# EasyEDA Pro project CH32V203_Wireless_Charge_V1.1.eprj, schematic CH32V203_Wireless_Charge
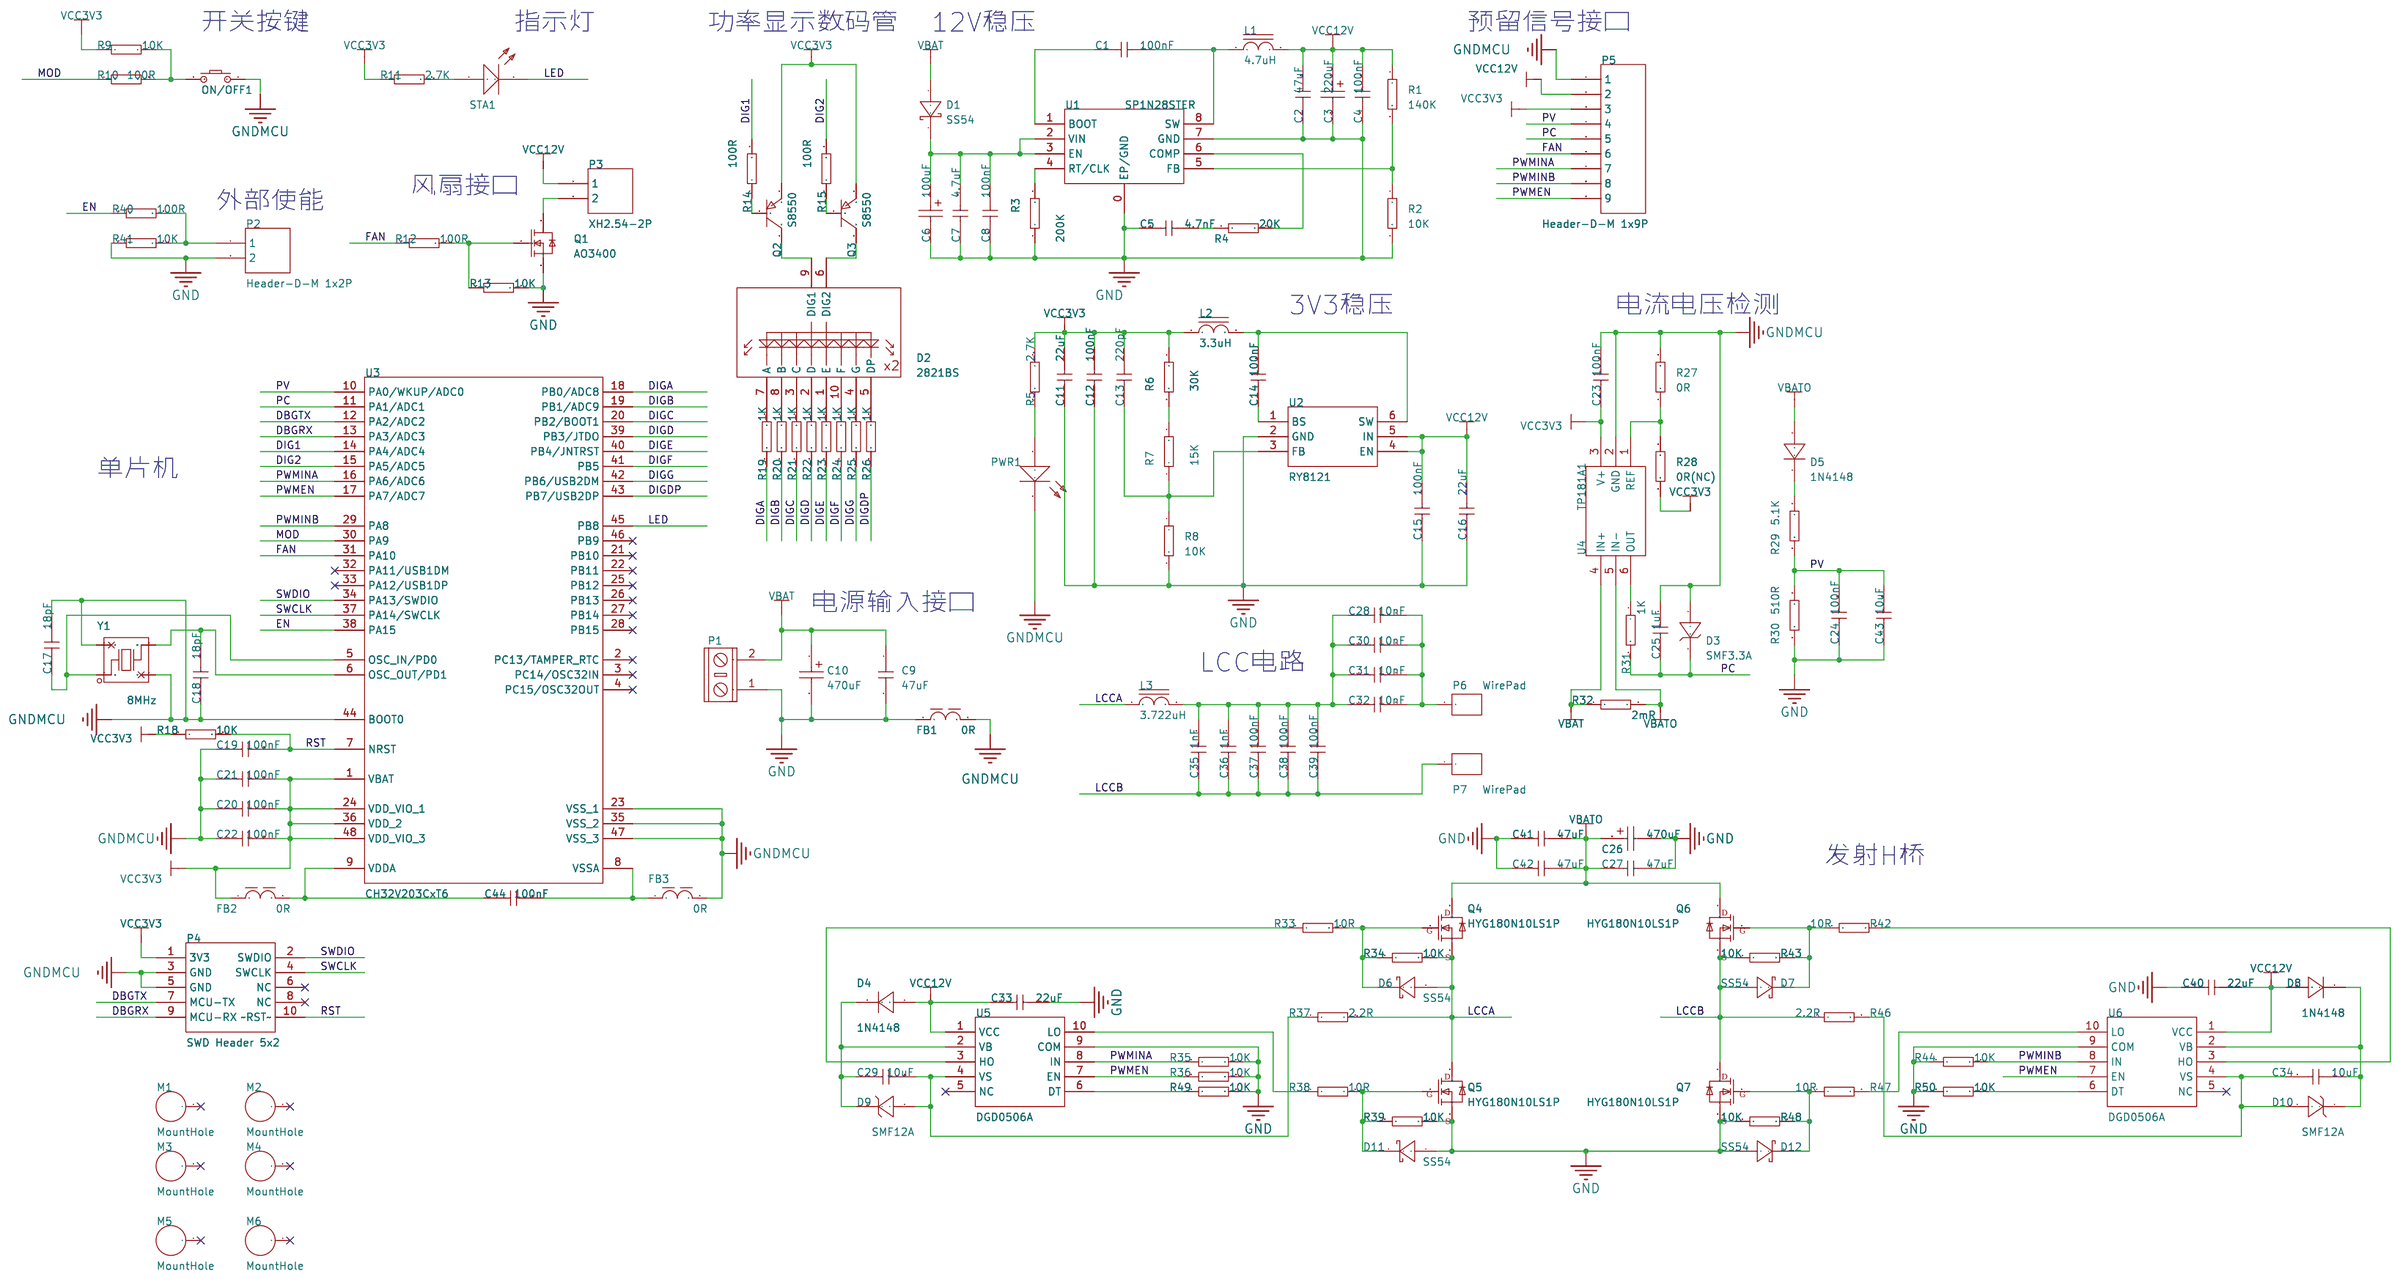
[diagram p0: schematic sheet]

## Parts
C1  100nF  [CAPC1608[0603]S-N]
C2  47uF  [CAPC3216[1206]S]
C3  220uF  [Cap-S-D 2.5-6.3X8]
C4  100nF  [CAPC1608[0603]S-N]
C5  4.7nF  [CAPC1608[0603]S-N]
C6  100uF  [Cap-S-D 2.5-6.3X8]
C7  4.7uF  [CAPC3216[1206]S]
C8  100nF  [CAPC1608[0603]S-N]
C9  47uF  [CAPC4532[1812]S]
C10  470uF  [Cap-S-D 3.5-8x14]
C11  22uF  [CAPC2012[0805]S-N]
C12  100nF  [CAPC1608[0603]S-N]
C13  220pF  [CAPC1608[0603]S-N]
C14  100nF  [CAPC1608[0603]S-N]
C15  100nF  [CAPC1608[0603]S-N]
C16  22uF  [CAPC2012[0805]S-N]
C17  18pF  [CAPC1608[0603]S-N]
C18  18pF  [CAPC1608[0603]S-N]
C19  100nF  [CAPC1608[0603]S-N]
C20  100nF  [CAPC1608[0603]S-N]
C21  100nF  [CAPC1608[0603]S-N]
C22  100nF  [CAPC1608[0603]S-N]
C23  100nF  [CAPC1608[0603]S-N]
C24  100nF  [CAPC1608[0603]S-N]
C25  1uF  [CAPC1608[0603]S-N]
C26  470uF  [Cap-S-D 3.5-8x14]
C27  47uF  [CAPC4532[1812]S]
C28  10nF  [CAPC3216[1206]S]
C29  10uF  [CAPC2012[0805]S-N]
C30  10nF  [CAPC3216[1206]S]
C31  10nF  [CAPC3216[1206]S]
C32  10nF  [CAPC3216[1206]S]
C33  22uF  [CAPC2012[0805]S-N]
C34  10uF  [CAPC2012[0805]S-N]
C35  1nF  [CAPC3216[1206]S]
C36  1nF  [CAPC3216[1206]S]
C37  100nF  [CAPC3216[1206]S]
C38  100nF  [CAPC3216[1206]S]
C39  100nF  [CAPC3216[1206]S]
C40  22uF  [CAPC2012[0805]S-N]
C41  47uF  [CAPC4532[1812]S]
C42  47uF  [CAPC4532[1812]S]
C43  10uF  [CAPC2012[0805]S-N]
C44  100nF  [CAPC1608[0603]S-N]
D1  SS54  [SMA-L[DO-214AC]]
D2  2821BS  [2821AS/BS]
D3  SMF3.3A  [SOD-123-L]
D4  1N4148  [SOD-123-L]
D5  1N4148  [SOD-123-L]
D6  SS54  [SMA-L[DO-214AC]]
D7  SS54  [SMA-L[DO-214AC]]
D8  1N4148  [SOD-123-L]
D9  SMF12A  [SOD-123-L]
D10  SMF12A  [SOD-123-L]
D11  SS54  [SMA-L[DO-214AC]]
D12  SS54  [SMA-L[DO-214AC]]
FB1  0R  [INDC1608[0603]S]
FB2  0R  [INDC1608[0603]S]
FB3  0R  [INDC1608[0603]S]
L1  4.7uH  [0630 TPC 7*7*3]
L2  3.3uH  [0402 TPC 4*4*2]
L3  3.722uH  [T94/106-LAY]
M1  MountHole  [M3-MountHole-Plated]
M2  MountHole  [M3-MountHole-Plated]
M3  MountHole  [M3-MountHole-Plated]
M4  MountHole  [M3-MountHole-Plated]
M5  MountHole  [M3-MountHole-Plated]
M6  MountHole  [M3-MountHole-Plated]
ON/OFF1  Button  [KEY-2-DIP-6*6-S]
P1  KF/WJ/DG 30x connecter  [KF/WJ/DG 301-2p-5.0mm]
P2  Header-D-M 1x2P  [HDR1X2-M]
P3  XH2.54-2P  [XH2.54-2P-DV]
P4  SWD  [HDR2X5-M]
P5  Header-D-M 1x9P  [HDR1X9-M]
P6  WirePad  [WirePad-4x6]
P7  WirePad  [WirePad-4x6]
PWR1  LED 3R  [LED-R3-H5-SINGLE-R]
Q1  AO3400  [SOT-23]
Q2  S8550  [SOT-23]
Q3  S8550  [SOT-23]
Q4  HYG180N10LS1P  [TO-220-LAY]
Q5  HYG180N10LS1P  [TO-220-LAY]
Q6  HYG180N10LS1P  [TO-220-LAY]
Q7  HYG180N10LS1P  [TO-220-LAY]
R1  140K  [RESC1608[0603]S-N]
R2  10K  [RESC1608[0603]S-N]
R3  200K  [RESC1608[0603]S-N]
R4  20K  [RESC1608[0603]S-N]
R5  2.7K  [RESC1608[0603]S-N]
R6  30K  [RESC1608[0603]S-N]
R7  15K  [RESC1608[0603]S-N]
R8  10K  [RESC1608[0603]S-N]
R9  10K  [RESC1608[0603]S-N]
R10  100R  [RESC1608[0603]S-N]
R11  2.7K  [RESC1608[0603]S-N]
R12  100R  [RESC1608[0603]S-N]
R13  10K  [RESC1608[0603]S-N]
R14  100R  [RESC1608[0603]S-N]
R15  100R  [RESC1608[0603]S-N]
R18  10K  [RESC1608[0603]S-N]
R19  1K  [RESC1608[0603]S-N]
R20  1K  [RESC1608[0603]S-N]
R21  1K  [RESC1608[0603]S-N]
R22  1K  [RESC1608[0603]S-N]
R23  1K  [RESC1608[0603]S-N]
R24  1K  [RESC1608[0603]S-N]
R25  1K  [RESC1608[0603]S-N]
R26  1K  [RESC1608[0603]S-N]
R27  0R  [RESC1608[0603]S-N]
R28  0R(NC)  [RESC1608[0603]S-N]
R29  5.1K  [RESC1608[0603]S-N]
R30  510R  [RESC1608[0603]S-N]
R31  1K  [RESC1608[0603]S-N]
R32  2mR  [RESC6332[2512]S]
R33  10R  [RESC2012[0805]S-N]
R34  10K  [RESC1608[0603]S-N]
R35  10K  [RESC1608[0603]S-N]
R36  10K  [RESC1608[0603]S-N]
R37  2.2R  [RESC2012[0805]S-N]
R38  10R  [RESC2012[0805]S-N]
R39  10K  [RESC1608[0603]S-N]
R40  100R  [RESC1608[0603]S-N]
R41  10K  [RESC1608[0603]S-N]
R42  10R  [RESC2012[0805]S-N]
R43  10K  [RESC1608[0603]S-N]
R44  10K  [RESC1608[0603]S-N]
R46  2.2R  [RESC2012[0805]S-N]
R47  10R  [RESC2012[0805]S-N]
R48  10K  [RESC1608[0603]S-N]
R49  10K  [RESC1608[0603]S-N]
R50  10K  [RESC1608[0603]S-N]
STA1  LED  [LED-R3-H5-SINGLE-B]
U1  SP1N28STER  [SOP-8E]
U2  RY8121  [SOT-23-6]
U3  CH32V203CxT6  [LQFP48_L]
U4  TP181A1  [SOT-363]
U5  DGD0506A  [MSOP-10]
U6  DGD0506A  [MSOP-10]
Y1  8MHz  [X3225-4]

## Library data of the parts
C1 C4 C8 C12 C14 C15 C19-C24 C44 = 100nF 0603 50V X7R: Revision: V1.0; Voltage: 50V; Type: X7R; Origin Footprint 2: CAPC1608[0603]-L; Origin Footprint 3: CAPC1608[0603]-M; Origin Footprint 4: CAPC1608[0603]-N; Origin Footprint 5: CAPC1608[0603]S-L; Origin Footprint 6: CAPC1608[0603]S-M
C2 = 47uF 1206 25V X5R: Revision: V1.0; Voltage: 25V; Type: X5R; Origin Footprint 2: CAPC3216[1206]
C3 = S-D 220uF 25V 6.3x8: Revision: V1.0; Type: 聚合物固态; Voltage: 25V
C5 = 4.7nF 0603 50V X7R: Revision: V1.0; Voltage: 50V; Type: X7R; Origin Footprint 2: CAPC1608[0603]-L; Origin Footprint 3: CAPC1608[0603]-M; Origin Footprint 4: CAPC1608[0603]-N; Origin Footprint 5: CAPC1608[0603]S-L; Origin Footprint 6: CAPC1608[0603]S-M
C6 = S-D 100uF 35V 6.3x8: Revision: V1.0; Type: 聚合物固态; Voltage: 35V
C7 = 4.7uF 1206 35V X5R: Revision: V1.0; Voltage: 35V; Type: X5R; Origin Footprint 2: CAPC3216[1206]
C9 C27 C41 C42 = 47uF 1812 50V X5R: Revision: V1.0; Voltage: 50V; Type: X5R; Origin Footprint 2: CAPC4532[1812]
C10 C26 = S-D 470uF 35V 8x14: Revision: V1.0; Type: 聚合物固态; Voltage: 35V
C11 C16 C33 C40 = 22uF 0805 25V X5R: Revision: V1.0; Voltage: 25V; Type: X5R; Origin Footprint 2: CAPC2012[0805]; Origin Footprint 3: CAPC2012[0805]S-L; Origin Footprint 4: CAPC2012[0805]S-M
C13 = 220pF 0603 50V X7R: Revision: V1.0; Voltage: 50V; Type: X7R; Origin Footprint 2: CAPC1608[0603]-L; Origin Footprint 3: CAPC1608[0603]-M; Origin Footprint 4: CAPC1608[0603]-N; Origin Footprint 5: CAPC1608[0603]S-L; Origin Footprint 6: CAPC1608[0603]S-M
C17 C18 = 18pF 0603 50V COG: Revision: V1.0; Voltage: 50V; Type: COG; Origin Footprint 2: CAPC1608[0603]-L; Origin Footprint 3: CAPC1608[0603]-M; Origin Footprint 4: CAPC1608[0603]-N; Origin Footprint 5: CAPC1608[0603]S-L; Origin Footprint 6: CAPC1608[0603]S-M
C25 = 1uF 0603 16V X7R: Revision: V1.0; Voltage: 16V; Type: X7R; Origin Footprint 2: CAPC1608[0603]-L; Origin Footprint 3: CAPC1608[0603]-M; Origin Footprint 4: CAPC1608[0603]-N; Origin Footprint 5: CAPC1608[0603]S-L; Origin Footprint 6: CAPC1608[0603]S-M
C28 C30-C32 = 10nF 1206 100V C0G: Revision: V1.0; Voltage: 100V; Type: C0G; Origin Footprint 2: CAPC3216[1206]
C29 C34 C43 = 10uF 0805 25V X5R: Revision: V1.0; Voltage: 25V; Type: X5R; Origin Footprint 2: CAPC2012[0805]; Origin Footprint 3: CAPC2012[0805]S-L; Origin Footprint 4: CAPC2012[0805]S-M
C35 C36 = 1nF 1206 100V C0G: Revision: V1.0; Voltage: 100V; Type: C0G; Origin Footprint 2: CAPC3216[1206]
C37-C39 = 100nF 1206 100V C0G: Revision: V1.0; Voltage: 100V; Type: C0G; Origin Footprint 2: CAPC3216[1206]
D1 D6 D7 D11 D12 = SS54: Revision: V1.0
D2 = 2821BS
D3 = Diode TVS Uni-Dir_1: Published: 8-Jun-2000; Publisher: Altium Limited; Price(RMB): 0.000; Imax: 500mA; Origin Footprint 2: DO-41; Origin Footprint 3: SMA[DO-214AC]; Origin Footprint 4: SMB[DO-214AA]; Origin Footprint 5: SMC[DO-214AB]; Origin Footprint 6: SOD-123-FL; Origin Footprint 7: SOD-323; Origin Footprint 8: SOD-523-L; Origin Footprint 9: SOD-123-M; Origin Footprint 10: SOD-523-M
D4 D5 D8 = Diode: Published: 8-Jun-2000; Revision: July-2002: Re-released for DXP Platform.; Publisher: Altium Limited; Price(RMB): 0.000; Imax: 500mA; Origin Footprint 2: SMB[DO-214AA]; Origin Footprint 3: SMC[DO-214AB]; Origin Footprint 4: SMA[DO-214AC]; Origin Footprint 5: SOD-123-FL; Origin Footprint 6: SOD-123-M; Origin Footprint 7: SOD-323; Origin Footprint 8: SOD-523-L; Origin Footprint 9: SOD-523-M
D9 D10 = Diode TVS Uni-Dir: Published: 8-Jun-2000; Publisher: Altium Limited; Price(RMB): 0.000; Imax: 500mA; Origin Footprint 2: DO-41; Origin Footprint 3: SMA[DO-214AC]; Origin Footprint 4: SMB[DO-214AA]; Origin Footprint 5: SMC[DO-214AB]; Origin Footprint 6: SOD-123-FL; Origin Footprint 7: SOD-323; Origin Footprint 8: SOD-523-L; Origin Footprint 9: SOD-123-M; Origin Footprint 10: SOD-523-M
FB1-FB3 = FB-Chip: Published: 2020-12-18; Revision: V1.0; DCR: .1m; Frequency: @100MHz; Imax: 500mA; Origin Footprint 2: INDC2012[0805]S; Origin Footprint 3: INDC3216[1206]S; Origin Footprint 4: INDC4509[1806]S; Origin Footprint 5: INDC1005[0402]; Origin Footprint 6: INDC1608[0603]; Origin Footprint 7: INDC2012[0805]; Origin Footprint 8: INDC3216[1206]; Origin Footprint 9: INDC3225[1210]; Origin Footprint 10: INDC3216[1206]; Origin Footprint 11: INDC1005[0402]S
L1 = Ind-Power: Published: 8-Jun-2000; Revision: July-2002: Re-released for DXP Platform.; Publisher: Altium Limited; DCR: .5m; Price(RMB): 0.000; Imax: 5A; Origin Footprint 2: CD31; Origin Footprint 3: CD32; Origin Footprint 4: CD42; Origin Footprint 5: CD43; Origin Footprint 6: CD52; Origin Footprint 7: CD53; Origin Footprint 8: CD54; Origin Footprint 9: CD73; Origin Footprint 10: CD75; Origin Footprint 11: CD104; Origin Footprint 12: CD105; Origin Footprint 13: CD106; Origin Footprint 14: 127 Shielded 12.5*12.5*7; Origin Footprint 15: 1050 TPC 10*10*5; Origin Footprint 16: 1265 TPC 12*12*6.5; Origin Footprint 17: CD104R; Origin Footprint 18: SLO2520; Origin Footprint 19: 1365 TPC 13*13*6.5; Origin Footprint 20: INDUCTOR; Origin Footprint 21: 0402 TPC 4*4*2; Origin Footprint 22: INDUCTOR-H
L2 = Ind-Power_1: Published: 8-Jun-2000; Revision: July-2002: Re-released for DXP Platform.; Publisher: Altium Limited; DCR: .5m; Price(RMB): 0.000; Imax: 2.5A; Origin Footprint 2: CD31; Origin Footprint 3: CD32; Origin Footprint 4: CD42; Origin Footprint 5: CD43; Origin Footprint 6: CD52; Origin Footprint 7: CD53; Origin Footprint 8: CD54; Origin Footprint 9: CD73; Origin Footprint 10: CD75; Origin Footprint 11: CD104; Origin Footprint 12: CD105; Origin Footprint 13: CD106; Origin Footprint 14: 127 Shielded 12.5*12.5*7; Origin Footprint 15: 0630 TPC 7*7*3; Origin Footprint 16: 1050 TPC 10*10*5; Origin Footprint 17: 1265 TPC 12*12*6.5; Origin Footprint 18: CD104R; Origin Footprint 19: SLO2520; Origin Footprint 20: 1365 TPC 13*13*6.5; Origin Footprint 21: INDUCTOR; Origin Footprint 22: INDUCTOR-H
L3 = Ind-Power_2: Published: 8-Jun-2000; Revision: July-2002: Re-released for DXP Platform.; Publisher: Altium Limited; Imax: 50mA; DCR: .5m; Price(RMB): 0.000; Origin Footprint 2: CD31; Origin Footprint 3: CD32; Origin Footprint 4: CD42; Origin Footprint 5: CD43; Origin Footprint 6: CD52; Origin Footprint 7: CD53; Origin Footprint 8: CD54; Origin Footprint 9: CD73; Origin Footprint 10: CD75; Origin Footprint 11: CD104; Origin Footprint 12: CD105; Origin Footprint 13: CD106; Origin Footprint 14: 127 Shielded 12.5*12.5*7; Origin Footprint 15: 0630 TPC 7*7*3; Origin Footprint 16: 1050 TPC 10*10*5; Origin Footprint 17: 1265 TPC 12*12*6.5; Origin Footprint 18: CD104R; Origin Footprint 19: SLO2520; Origin Footprint 20: 1365 TPC 13*13*6.5; Origin Footprint 21: T80125
M1-M6 = MountHole: Origin Footprint 2: M3-MountHole; Origin Footprint 3: M3-MountSlot; Origin Footprint 4: M3-MountSlot-Plated; Origin Footprint 5: M3-MountHole-4mm; Origin Footprint 6: M3-MountHole-5mm; Origin Footprint 7: M3-MountHole-6mm; Origin Footprint 8: M3-MountHole-7mm; Origin Footprint 9: M3-MountHole-8mm; Origin Footprint 10: M3-MountHole-9mm; Origin Footprint 11: M3-MountHole-10mm; Origin Footprint 12: M3-MountHole-11mm; Origin Footprint 13: M3-MountHole-12mm; Origin Footprint 14: M3-MountHole-13mm; Origin Footprint 15: M3-MountHole-14mm; Origin Footprint 16: M3-MountHole-15mm; Origin Footprint 17: M3-MountHole-16mm; Origin Footprint 18: M3-MountHole-17mm; Origin Footprint 19: M3-MountHole-18mm; Origin Footprint 20: M3-MountHole-19mm; Origin Footprint 21: M3-MountHole-20mm; Origin Footprint 22: M3-MountHole-Plated-4MM; Origin Footprint 23: M3-MountHole-Plated-5MM; Origin Footprint 24: M3-MountHole-Plated-6MM; Origin Footprint 25: M3-MountHole-Plated-7MM; Origin Footprint 26: M3-MountHole-Plated-8MM; Origin Footprint 27: M3-MountHole-Plated-9MM; Origin Footprint 28: M3-MountHole-Plated-10MM; Origin Footprint 29: M3-MountHole-Plated-11MM; Origin Footprint 30: M3-MountHole-Plated-12MM; Origin Footprint 31: M3-MountHole-Plated-13MM; Origin Footprint 32: M3-MountHole-Plated-14MM; Origin Footprint 33: M3-MountHole-Plated-15MM; Origin Footprint 34: M3-MountHole-Plated-16MM; Origin Footprint 35: M3-MountHole-Plated-17MM; Origin Footprint 36: M3-MountHole-Plated-18MM; Origin Footprint 37: M3-MountHole-Plated-19MM; Origin Footprint 38: M3-MountHole-Plated-20MM
ON/OFF1 = KEY: Published: 24-Mar-1999; Publisher: Altium Limited; Price(RMB): 0.000; Origin Footprint 2: KEY-2-SMD-3*4; Origin Footprint 3: KEY-4-DIP-6*6; Origin Footprint 4: PTS810-3*4-CurvePin; Origin Footprint 5: KEY-2-SMD-3*6-L; Origin Footprint 6: KEY-2-SMD-3*6-M; Origin Footprint 7: KEY-4-SMD-6*6; Origin Footprint 8: KEY-2-SMD-Side-3*6*3.5; Origin Footprint 9: KEY-4-SMD-12*12; Origin Footprint 10: TS-1809SM-A; Origin Footprint 11: TS-1199A
P1 = KF/WJ/DG 30x
P2 = Header-D-M 1x2P: Revision: V1.0
P3 = XH2.54-2P: Revision: V1.0; Origin Footprint 2: XH2.54-2P-DH; Origin Footprint 3: XH2.54-2P-SH
P4 = SWD Header 5x2: Revision: V1.0; Origin Footprint 2: HDR2X5-M-SMT
P5 = Header-D-M 1x9P: Revision: V1.0
P6 P7 = WirePad: Origin Footprint 2: WirePad-4.5x7
PWR1 = LED DIP Red: Published: 8-Jun-2000; Revision: July-2002: Re-released for DXP Platform.; Publisher: Altium Limited; Price(RMB): 0.00; Origin Footprint 2: LED-R5-H9-SINGLE-R
Q1 = AO3400
Q2 Q3 = PNP S8550: Published: 8-Jun-2000; Revision: July-2002: Re-released for DXP Platform.; Publisher: Altium Limited; Price(RMB): 0.000
Q4-Q7 = HYG180N10LS1P: Origin Footprint 2: TO-220
R1 = Res-Chip_6: Revision: V1.0; Power: 1/8W; Tolerance: ±1%; Origin Footprint 2: RESC0603[0201]-L; Origin Footprint 3: RESC0603[0201]-M; Origin Footprint 4: RESC0603[0201]-N; Origin Footprint 5: RESC0603[0201]S-L; Origin Footprint 6: RESC0603[0201]S-M; Origin Footprint 7: RESC0603[0201]S-N; Origin Footprint 8: RESC1005[0402]-L; Origin Footprint 9: RESC1005[0402]S-M; Origin Footprint 10: RESC1005[0402]-M; Origin Footprint 11: RESC1005[0402]-N; Origin Footprint 12: RESC1005[0402]S-L; Origin Footprint 13: RESC1005[0402]S-N; Origin Footprint 14: RESC1608[0603]-L; Origin Footprint 15: RESC1608[0603]-M; Origin Footprint 16: RESC1608[0603]-N; Origin Footprint 17: RESC1608[0603]S-L; Origin Footprint 18: RESC1608[0603]S-M; Origin Footprint 19: RESC2012[0805]; Origin Footprint 20: RESC2012[0805]S-L; Origin Footprint 21: RESC2012[0805]S-M; Origin Footprint 22: RESC2012[0805]S-N; Origin Footprint 23: RESC3216[1206]; Origin Footprint 24: RESC3216[1206]S-L; Origin Footprint 25: RESC3216[1206]S-M; Origin Footprint 26: RESC3216[1206]S-N; Origin Footprint 27: RESC3225[1210]; Origin Footprint 28: RESC3225[1210]S; Origin Footprint 29: RESC5025[2010]; Origin Footprint 30: RESC5025[2010]S; Origin Footprint 31: RESC6332[2512]; Origin Footprint 32: RESC6332[2512]S
R2 R8 R9 R13 R18 R34-R36 R39 R41 R43 R44 R48-R50 = Res-Chip: Revision: V1.0; Power: 1/8W; Tolerance: ±1%; Origin Footprint 2: RESC0603[0201]-L; Origin Footprint 3: RESC0603[0201]-M; Origin Footprint 4: RESC0603[0201]-N; Origin Footprint 5: RESC0603[0201]S-L; Origin Footprint 6: RESC0603[0201]S-M; Origin Footprint 7: RESC0603[0201]S-N; Origin Footprint 8: RESC1005[0402]-L; Origin Footprint 9: RESC1005[0402]S-M; Origin Footprint 10: RESC1005[0402]-M; Origin Footprint 11: RESC1005[0402]-N; Origin Footprint 12: RESC1005[0402]S-L; Origin Footprint 13: RESC1005[0402]S-N; Origin Footprint 14: RESC1608[0603]-L; Origin Footprint 15: RESC1608[0603]-M; Origin Footprint 16: RESC1608[0603]-N; Origin Footprint 17: RESC1608[0603]S-L; Origin Footprint 18: RESC1608[0603]S-M; Origin Footprint 19: RESC2012[0805]; Origin Footprint 20: RESC2012[0805]S-L; Origin Footprint 21: RESC2012[0805]S-M; Origin Footprint 22: RESC2012[0805]S-N; Origin Footprint 23: RESC3216[1206]; Origin Footprint 24: RESC3216[1206]S-L; Origin Footprint 25: RESC3216[1206]S-M; Origin Footprint 26: RESC3216[1206]S-N; Origin Footprint 27: RESC3225[1210]; Origin Footprint 28: RESC3225[1210]S; Origin Footprint 29: RESC5025[2010]; Origin Footprint 30: RESC5025[2010]S; Origin Footprint 31: RESC6332[2512]; Origin Footprint 32: RESC6332[2512]S
R3 = Res-Chip_4: Revision: V1.0; Power: 1/8W; Tolerance: ±1%; Origin Footprint 2: RESC0603[0201]-L; Origin Footprint 3: RESC0603[0201]-M; Origin Footprint 4: RESC0603[0201]-N; Origin Footprint 5: RESC0603[0201]S-L; Origin Footprint 6: RESC0603[0201]S-M; Origin Footprint 7: RESC0603[0201]S-N; Origin Footprint 8: RESC1005[0402]-L; Origin Footprint 9: RESC1005[0402]S-M; Origin Footprint 10: RESC1005[0402]-M; Origin Footprint 11: RESC1005[0402]-N; Origin Footprint 12: RESC1005[0402]S-L; Origin Footprint 13: RESC1005[0402]S-N; Origin Footprint 14: RESC1608[0603]-L; Origin Footprint 15: RESC1608[0603]-M; Origin Footprint 16: RESC1608[0603]-N; Origin Footprint 17: RESC1608[0603]S-L; Origin Footprint 18: RESC1608[0603]S-M; Origin Footprint 19: RESC2012[0805]; Origin Footprint 20: RESC2012[0805]S-L; Origin Footprint 21: RESC2012[0805]S-M; Origin Footprint 22: RESC2012[0805]S-N; Origin Footprint 23: RESC3216[1206]; Origin Footprint 24: RESC3216[1206]S-L; Origin Footprint 25: RESC3216[1206]S-M; Origin Footprint 26: RESC3216[1206]S-N; Origin Footprint 27: RESC3225[1210]; Origin Footprint 28: RESC3225[1210]S; Origin Footprint 29: RESC5025[2010]; Origin Footprint 30: RESC5025[2010]S; Origin Footprint 31: RESC6332[2512]; Origin Footprint 32: RESC6332[2512]S
R4 = Res-Chip_5: Revision: V1.0; Power: 1/8W; Tolerance: ±1%; Origin Footprint 2: RESC0603[0201]-L; Origin Footprint 3: RESC0603[0201]-M; Origin Footprint 4: RESC0603[0201]-N; Origin Footprint 5: RESC0603[0201]S-L; Origin Footprint 6: RESC0603[0201]S-M; Origin Footprint 7: RESC0603[0201]S-N; Origin Footprint 8: RESC1005[0402]-L; Origin Footprint 9: RESC1005[0402]S-M; Origin Footprint 10: RESC1005[0402]-M; Origin Footprint 11: RESC1005[0402]-N; Origin Footprint 12: RESC1005[0402]S-L; Origin Footprint 13: RESC1005[0402]S-N; Origin Footprint 14: RESC1608[0603]-L; Origin Footprint 15: RESC1608[0603]-M; Origin Footprint 16: RESC1608[0603]-N; Origin Footprint 17: RESC1608[0603]S-L; Origin Footprint 18: RESC1608[0603]S-M; Origin Footprint 19: RESC2012[0805]; Origin Footprint 20: RESC2012[0805]S-L; Origin Footprint 21: RESC2012[0805]S-M; Origin Footprint 22: RESC2012[0805]S-N; Origin Footprint 23: RESC3216[1206]; Origin Footprint 24: RESC3216[1206]S-L; Origin Footprint 25: RESC3216[1206]S-M; Origin Footprint 26: RESC3216[1206]S-N; Origin Footprint 27: RESC3225[1210]; Origin Footprint 28: RESC3225[1210]S; Origin Footprint 29: RESC5025[2010]; Origin Footprint 30: RESC5025[2010]S; Origin Footprint 31: RESC6332[2512]; Origin Footprint 32: RESC6332[2512]S
R5 R11 = Res-Chip_3: Revision: V1.0; Power: 1/8W; Tolerance: ±1%; Origin Footprint 2: RESC0603[0201]-L; Origin Footprint 3: RESC0603[0201]-M; Origin Footprint 4: RESC0603[0201]-N; Origin Footprint 5: RESC0603[0201]S-L; Origin Footprint 6: RESC0603[0201]S-M; Origin Footprint 7: RESC0603[0201]S-N; Origin Footprint 8: RESC1005[0402]-L; Origin Footprint 9: RESC1005[0402]S-M; Origin Footprint 10: RESC1005[0402]-M; Origin Footprint 11: RESC1005[0402]-N; Origin Footprint 12: RESC1005[0402]S-L; Origin Footprint 13: RESC1005[0402]S-N; Origin Footprint 14: RESC1608[0603]-L; Origin Footprint 15: RESC1608[0603]-M; Origin Footprint 16: RESC1608[0603]-N; Origin Footprint 17: RESC1608[0603]S-L; Origin Footprint 18: RESC1608[0603]S-M; Origin Footprint 19: RESC2012[0805]; Origin Footprint 20: RESC2012[0805]S-L; Origin Footprint 21: RESC2012[0805]S-M; Origin Footprint 22: RESC2012[0805]S-N; Origin Footprint 23: RESC3216[1206]; Origin Footprint 24: RESC3216[1206]S-L; Origin Footprint 25: RESC3216[1206]S-M; Origin Footprint 26: RESC3216[1206]S-N; Origin Footprint 27: RESC3225[1210]; Origin Footprint 28: RESC3225[1210]S; Origin Footprint 29: RESC5025[2010]; Origin Footprint 30: RESC5025[2010]S; Origin Footprint 31: RESC6332[2512]; Origin Footprint 32: RESC6332[2512]S
R6 = Res-Chip_8: Revision: V1.0; Power: 1/8W; Tolerance: ±1%; Origin Footprint 2: RESC0603[0201]-L; Origin Footprint 3: RESC0603[0201]-M; Origin Footprint 4: RESC0603[0201]-N; Origin Footprint 5: RESC0603[0201]S-L; Origin Footprint 6: RESC0603[0201]S-M; Origin Footprint 7: RESC0603[0201]S-N; Origin Footprint 8: RESC1005[0402]-L; Origin Footprint 9: RESC1005[0402]S-M; Origin Footprint 10: RESC1005[0402]-M; Origin Footprint 11: RESC1005[0402]-N; Origin Footprint 12: RESC1005[0402]S-L; Origin Footprint 13: RESC1005[0402]S-N; Origin Footprint 14: RESC1608[0603]-L; Origin Footprint 15: RESC1608[0603]-M; Origin Footprint 16: RESC1608[0603]-N; Origin Footprint 17: RESC1608[0603]S-L; Origin Footprint 18: RESC1608[0603]S-M; Origin Footprint 19: RESC2012[0805]; Origin Footprint 20: RESC2012[0805]S-L; Origin Footprint 21: RESC2012[0805]S-M; Origin Footprint 22: RESC2012[0805]S-N; Origin Footprint 23: RESC3216[1206]; Origin Footprint 24: RESC3216[1206]S-L; Origin Footprint 25: RESC3216[1206]S-M; Origin Footprint 26: RESC3216[1206]S-N; Origin Footprint 27: RESC3225[1210]; Origin Footprint 28: RESC3225[1210]S; Origin Footprint 29: RESC5025[2010]; Origin Footprint 30: RESC5025[2010]S; Origin Footprint 31: RESC6332[2512]; Origin Footprint 32: RESC6332[2512]S
R7 = Res-Chip_7: Revision: V1.0; Power: 1/8W; Tolerance: ±1%; Origin Footprint 2: RESC0603[0201]-L; Origin Footprint 3: RESC0603[0201]-M; Origin Footprint 4: RESC0603[0201]-N; Origin Footprint 5: RESC0603[0201]S-L; Origin Footprint 6: RESC0603[0201]S-M; Origin Footprint 7: RESC0603[0201]S-N; Origin Footprint 8: RESC1005[0402]-L; Origin Footprint 9: RESC1005[0402]S-M; Origin Footprint 10: RESC1005[0402]-M; Origin Footprint 11: RESC1005[0402]-N; Origin Footprint 12: RESC1005[0402]S-L; Origin Footprint 13: RESC1005[0402]S-N; Origin Footprint 14: RESC1608[0603]-L; Origin Footprint 15: RESC1608[0603]-M; Origin Footprint 16: RESC1608[0603]-N; Origin Footprint 17: RESC1608[0603]S-L; Origin Footprint 18: RESC1608[0603]S-M; Origin Footprint 19: RESC2012[0805]; Origin Footprint 20: RESC2012[0805]S-L; Origin Footprint 21: RESC2012[0805]S-M; Origin Footprint 22: RESC2012[0805]S-N; Origin Footprint 23: RESC3216[1206]; Origin Footprint 24: RESC3216[1206]S-L; Origin Footprint 25: RESC3216[1206]S-M; Origin Footprint 26: RESC3216[1206]S-N; Origin Footprint 27: RESC3225[1210]; Origin Footprint 28: RESC3225[1210]S; Origin Footprint 29: RESC5025[2010]; Origin Footprint 30: RESC5025[2010]S; Origin Footprint 31: RESC6332[2512]; Origin Footprint 32: RESC6332[2512]S
R10 R12 R14 R15 R40 = Res-Chip_1: Revision: V1.0; Power: 1/8W; Tolerance: ±1%; Origin Footprint 2: RESC0603[0201]-L; Origin Footprint 3: RESC0603[0201]-M; Origin Footprint 4: RESC0603[0201]-N; Origin Footprint 5: RESC0603[0201]S-L; Origin Footprint 6: RESC0603[0201]S-M; Origin Footprint 7: RESC0603[0201]S-N; Origin Footprint 8: RESC1005[0402]-L; Origin Footprint 9: RESC1005[0402]S-M; Origin Footprint 10: RESC1005[0402]-M; Origin Footprint 11: RESC1005[0402]-N; Origin Footprint 12: RESC1005[0402]S-L; Origin Footprint 13: RESC1005[0402]S-N; Origin Footprint 14: RESC1608[0603]-L; Origin Footprint 15: RESC1608[0603]-M; Origin Footprint 16: RESC1608[0603]-N; Origin Footprint 17: RESC1608[0603]S-L; Origin Footprint 18: RESC1608[0603]S-M; Origin Footprint 19: RESC2012[0805]; Origin Footprint 20: RESC2012[0805]S-L; Origin Footprint 21: RESC2012[0805]S-M; Origin Footprint 22: RESC2012[0805]S-N; Origin Footprint 23: RESC3216[1206]; Origin Footprint 24: RESC3216[1206]S-L; Origin Footprint 25: RESC3216[1206]S-M; Origin Footprint 26: RESC3216[1206]S-N; Origin Footprint 27: RESC3225[1210]; Origin Footprint 28: RESC3225[1210]S; Origin Footprint 29: RESC5025[2010]; Origin Footprint 30: RESC5025[2010]S; Origin Footprint 31: RESC6332[2512]; Origin Footprint 32: RESC6332[2512]S
R19-R26 R31 = Res-Chip_2: Revision: V1.0; Power: 1/8W; Tolerance: ±1%; Origin Footprint 2: RESC0603[0201]-L; Origin Footprint 3: RESC0603[0201]-M; Origin Footprint 4: RESC0603[0201]-N; Origin Footprint 5: RESC0603[0201]S-L; Origin Footprint 6: RESC0603[0201]S-M; Origin Footprint 7: RESC0603[0201]S-N; Origin Footprint 8: RESC1005[0402]-L; Origin Footprint 9: RESC1005[0402]S-M; Origin Footprint 10: RESC1005[0402]-M; Origin Footprint 11: RESC1005[0402]-N; Origin Footprint 12: RESC1005[0402]S-L; Origin Footprint 13: RESC1005[0402]S-N; Origin Footprint 14: RESC1608[0603]-L; Origin Footprint 15: RESC1608[0603]-M; Origin Footprint 16: RESC1608[0603]-N; Origin Footprint 17: RESC1608[0603]S-L; Origin Footprint 18: RESC1608[0603]S-M; Origin Footprint 19: RESC2012[0805]; Origin Footprint 20: RESC2012[0805]S-L; Origin Footprint 21: RESC2012[0805]S-M; Origin Footprint 22: RESC2012[0805]S-N; Origin Footprint 23: RESC3216[1206]; Origin Footprint 24: RESC3216[1206]S-L; Origin Footprint 25: RESC3216[1206]S-M; Origin Footprint 26: RESC3216[1206]S-N; Origin Footprint 27: RESC3225[1210]; Origin Footprint 28: RESC3225[1210]S; Origin Footprint 29: RESC5025[2010]; Origin Footprint 30: RESC5025[2010]S; Origin Footprint 31: RESC6332[2512]; Origin Footprint 32: RESC6332[2512]S
R27 = Res-Chip_12: Revision: V1.0; Power: 1/8W; Tolerance: ±1%; Origin Footprint 2: RESC0603[0201]-L; Origin Footprint 3: RESC0603[0201]-M; Origin Footprint 4: RESC0603[0201]-N; Origin Footprint 5: RESC0603[0201]S-L; Origin Footprint 6: RESC0603[0201]S-M; Origin Footprint 7: RESC0603[0201]S-N; Origin Footprint 8: RESC1005[0402]-L; Origin Footprint 9: RESC1005[0402]S-M; Origin Footprint 10: RESC1005[0402]-M; Origin Footprint 11: RESC1005[0402]-N; Origin Footprint 12: RESC1005[0402]S-L; Origin Footprint 13: RESC1005[0402]S-N; Origin Footprint 14: RESC1608[0603]-L; Origin Footprint 15: RESC1608[0603]-M; Origin Footprint 16: RESC1608[0603]-N; Origin Footprint 17: RESC1608[0603]S-L; Origin Footprint 18: RESC1608[0603]S-M; Origin Footprint 19: RESC2012[0805]; Origin Footprint 20: RESC2012[0805]S-L; Origin Footprint 21: RESC2012[0805]S-M; Origin Footprint 22: RESC2012[0805]S-N; Origin Footprint 23: RESC3216[1206]; Origin Footprint 24: RESC3216[1206]S-L; Origin Footprint 25: RESC3216[1206]S-M; Origin Footprint 26: RESC3216[1206]S-N; Origin Footprint 27: RESC3225[1210]; Origin Footprint 28: RESC3225[1210]S; Origin Footprint 29: RESC5025[2010]; Origin Footprint 30: RESC5025[2010]S; Origin Footprint 31: RESC6332[2512]; Origin Footprint 32: RESC6332[2512]S
R28 = Res-Chip_11: Revision: V1.0; Power: 1/8W; Tolerance: ±1%; Origin Footprint 2: RESC0603[0201]-L; Origin Footprint 3: RESC0603[0201]-M; Origin Footprint 4: RESC0603[0201]-N; Origin Footprint 5: RESC0603[0201]S-L; Origin Footprint 6: RESC0603[0201]S-M; Origin Footprint 7: RESC0603[0201]S-N; Origin Footprint 8: RESC1005[0402]-L; Origin Footprint 9: RESC1005[0402]S-M; Origin Footprint 10: RESC1005[0402]-M; Origin Footprint 11: RESC1005[0402]-N; Origin Footprint 12: RESC1005[0402]S-L; Origin Footprint 13: RESC1005[0402]S-N; Origin Footprint 14: RESC1608[0603]-L; Origin Footprint 15: RESC1608[0603]-M; Origin Footprint 16: RESC1608[0603]-N; Origin Footprint 17: RESC1608[0603]S-L; Origin Footprint 18: RESC1608[0603]S-M; Origin Footprint 19: RESC2012[0805]; Origin Footprint 20: RESC2012[0805]S-L; Origin Footprint 21: RESC2012[0805]S-M; Origin Footprint 22: RESC2012[0805]S-N; Origin Footprint 23: RESC3216[1206]; Origin Footprint 24: RESC3216[1206]S-L; Origin Footprint 25: RESC3216[1206]S-M; Origin Footprint 26: RESC3216[1206]S-N; Origin Footprint 27: RESC3225[1210]; Origin Footprint 28: RESC3225[1210]S; Origin Footprint 29: RESC5025[2010]; Origin Footprint 30: RESC5025[2010]S; Origin Footprint 31: RESC6332[2512]; Origin Footprint 32: RESC6332[2512]S
R29 = Res-Chip_14: Revision: V1.0; Power: 1/8W; Tolerance: ±1%; Origin Footprint 2: RESC0603[0201]-L; Origin Footprint 3: RESC0603[0201]-M; Origin Footprint 4: RESC0603[0201]-N; Origin Footprint 5: RESC0603[0201]S-L; Origin Footprint 6: RESC0603[0201]S-M; Origin Footprint 7: RESC0603[0201]S-N; Origin Footprint 8: RESC1005[0402]-L; Origin Footprint 9: RESC1005[0402]S-M; Origin Footprint 10: RESC1005[0402]-M; Origin Footprint 11: RESC1005[0402]-N; Origin Footprint 12: RESC1005[0402]S-L; Origin Footprint 13: RESC1005[0402]S-N; Origin Footprint 14: RESC1608[0603]-L; Origin Footprint 15: RESC1608[0603]-M; Origin Footprint 16: RESC1608[0603]-N; Origin Footprint 17: RESC1608[0603]S-L; Origin Footprint 18: RESC1608[0603]S-M; Origin Footprint 19: RESC2012[0805]; Origin Footprint 20: RESC2012[0805]S-L; Origin Footprint 21: RESC2012[0805]S-M; Origin Footprint 22: RESC2012[0805]S-N; Origin Footprint 23: RESC3216[1206]; Origin Footprint 24: RESC3216[1206]S-L; Origin Footprint 25: RESC3216[1206]S-M; Origin Footprint 26: RESC3216[1206]S-N; Origin Footprint 27: RESC3225[1210]; Origin Footprint 28: RESC3225[1210]S; Origin Footprint 29: RESC5025[2010]; Origin Footprint 30: RESC5025[2010]S; Origin Footprint 31: RESC6332[2512]; Origin Footprint 32: RESC6332[2512]S
R30 = Res-Chip_15: Revision: V1.0; Power: 1/8W; Tolerance: ±1%; Origin Footprint 2: RESC0603[0201]-L; Origin Footprint 3: RESC0603[0201]-M; Origin Footprint 4: RESC0603[0201]-N; Origin Footprint 5: RESC0603[0201]S-L; Origin Footprint 6: RESC0603[0201]S-M; Origin Footprint 7: RESC0603[0201]S-N; Origin Footprint 8: RESC1005[0402]-L; Origin Footprint 9: RESC1005[0402]S-M; Origin Footprint 10: RESC1005[0402]-M; Origin Footprint 11: RESC1005[0402]-N; Origin Footprint 12: RESC1005[0402]S-L; Origin Footprint 13: RESC1005[0402]S-N; Origin Footprint 14: RESC1608[0603]-L; Origin Footprint 15: RESC1608[0603]-M; Origin Footprint 16: RESC1608[0603]-N; Origin Footprint 17: RESC1608[0603]S-L; Origin Footprint 18: RESC1608[0603]S-M; Origin Footprint 19: RESC2012[0805]; Origin Footprint 20: RESC2012[0805]S-L; Origin Footprint 21: RESC2012[0805]S-M; Origin Footprint 22: RESC2012[0805]S-N; Origin Footprint 23: RESC3216[1206]; Origin Footprint 24: RESC3216[1206]S-L; Origin Footprint 25: RESC3216[1206]S-M; Origin Footprint 26: RESC3216[1206]S-N; Origin Footprint 27: RESC3225[1210]; Origin Footprint 28: RESC3225[1210]S; Origin Footprint 29: RESC5025[2010]; Origin Footprint 30: RESC5025[2010]S; Origin Footprint 31: RESC6332[2512]; Origin Footprint 32: RESC6332[2512]S
R32 = Res-Chip_10: Revision: V1.0; Power: 1/8W; Tolerance: ±1%; Origin Footprint 2: RESC0603[0201]-L; Origin Footprint 3: RESC0603[0201]-M; Origin Footprint 4: RESC0603[0201]-N; Origin Footprint 5: RESC0603[0201]S-L; Origin Footprint 6: RESC0603[0201]S-M; Origin Footprint 7: RESC0603[0201]S-N; Origin Footprint 8: RESC1005[0402]-L; Origin Footprint 9: RESC1005[0402]S-M; Origin Footprint 10: RESC1005[0402]-M; Origin Footprint 11: RESC1005[0402]-N; Origin Footprint 12: RESC1005[0402]S-L; Origin Footprint 13: RESC1005[0402]S-N; Origin Footprint 14: RESC1608[0603]-L; Origin Footprint 15: RESC1608[0603]-M; Origin Footprint 16: RESC1608[0603]-N; Origin Footprint 17: RESC1608[0603]S-L; Origin Footprint 18: RESC1608[0603]S-M; Origin Footprint 19: RESC1608[0603]S-N; Origin Footprint 20: RESC2012[0805]; Origin Footprint 21: RESC2012[0805]S-L; Origin Footprint 22: RESC2012[0805]S-M; Origin Footprint 23: RESC2012[0805]S-N; Origin Footprint 24: RESC3216[1206]; Origin Footprint 25: RESC3216[1206]S-L; Origin Footprint 26: RESC3216[1206]S-M; Origin Footprint 27: RESC3216[1206]S-N; Origin Footprint 28: RESC3225[1210]; Origin Footprint 29: RESC3225[1210]S; Origin Footprint 30: RESC5025[2010]; Origin Footprint 31: RESC5025[2010]S; Origin Footprint 32: RESC6332[2512]
R33 R38 R42 R47 = Res-Chip_9: Revision: V1.0; Power: 1/8W; Tolerance: ±1%; Origin Footprint 2: RESC0603[0201]-L; Origin Footprint 3: RESC0603[0201]-M; Origin Footprint 4: RESC0603[0201]-N; Origin Footprint 5: RESC0603[0201]S-L; Origin Footprint 6: RESC0603[0201]S-M; Origin Footprint 7: RESC0603[0201]S-N; Origin Footprint 8: RESC1005[0402]-L; Origin Footprint 9: RESC1005[0402]S-M; Origin Footprint 10: RESC1005[0402]-M; Origin Footprint 11: RESC1005[0402]-N; Origin Footprint 12: RESC1005[0402]S-L; Origin Footprint 13: RESC1005[0402]S-N; Origin Footprint 14: RESC1608[0603]-L; Origin Footprint 15: RESC1608[0603]-M; Origin Footprint 16: RESC1608[0603]-N; Origin Footprint 17: RESC1608[0603]S-L; Origin Footprint 18: RESC1608[0603]S-M; Origin Footprint 19: RESC1608[0603]S-N; Origin Footprint 20: RESC2012[0805]; Origin Footprint 21: RESC2012[0805]S-L; Origin Footprint 22: RESC2012[0805]S-M; Origin Footprint 23: RESC3216[1206]; Origin Footprint 24: RESC3216[1206]S-L; Origin Footprint 25: RESC3216[1206]S-M; Origin Footprint 26: RESC3216[1206]S-N; Origin Footprint 27: RESC3225[1210]; Origin Footprint 28: RESC3225[1210]S; Origin Footprint 29: RESC5025[2010]; Origin Footprint 30: RESC5025[2010]S; Origin Footprint 31: RESC6332[2512]; Origin Footprint 32: RESC6332[2512]S
R37 R46 = Res-Chip_13: Revision: V1.0; Power: 1/8W; Tolerance: ±1%; Origin Footprint 2: RESC0603[0201]-L; Origin Footprint 3: RESC0603[0201]-M; Origin Footprint 4: RESC0603[0201]-N; Origin Footprint 5: RESC0603[0201]S-L; Origin Footprint 6: RESC0603[0201]S-M; Origin Footprint 7: RESC0603[0201]S-N; Origin Footprint 8: RESC1005[0402]-L; Origin Footprint 9: RESC1005[0402]S-M; Origin Footprint 10: RESC1005[0402]-M; Origin Footprint 11: RESC1005[0402]-N; Origin Footprint 12: RESC1005[0402]S-L; Origin Footprint 13: RESC1005[0402]S-N; Origin Footprint 14: RESC1608[0603]-L; Origin Footprint 15: RESC1608[0603]-M; Origin Footprint 16: RESC1608[0603]-N; Origin Footprint 17: RESC1608[0603]S-L; Origin Footprint 18: RESC1608[0603]S-M; Origin Footprint 19: RESC1608[0603]S-N; Origin Footprint 20: RESC2012[0805]; Origin Footprint 21: RESC2012[0805]S-L; Origin Footprint 22: RESC2012[0805]S-M; Origin Footprint 23: RESC3216[1206]; Origin Footprint 24: RESC3216[1206]S-L; Origin Footprint 25: RESC3216[1206]S-M; Origin Footprint 26: RESC3216[1206]S-N; Origin Footprint 27: RESC3225[1210]; Origin Footprint 28: RESC3225[1210]S; Origin Footprint 29: RESC5025[2010]; Origin Footprint 30: RESC5025[2010]S; Origin Footprint 31: RESC6332[2512]; Origin Footprint 32: RESC6332[2512]S
STA1 = LED DIP Blue: Published: 8-Jun-2000; Revision: July-2002: Re-released for DXP Platform.; Publisher: Altium Limited; Price(RMB): 0.00; Origin Footprint 2: LED-R5-H9-SINGLE-B
U1 = SP1N28STER: Revision: V1.0
U2 = RY8121
U3 = CH32V203CxT6: Published: 30-May-2008; DatasheetVersion: rev6, Mar-2008; PackageVersion: Mar-2008; PackageReference: LQFP48; Publisher: Altium Limited; PackageDescription: 48-Pin Low-Profile Quad Flat Pack, 7 x 7 mm Body, 0.5 mm Pitch (LQFP48); ComponentLink1Description: Manufacturer Link; ComponentLink1URL: www.st.com/stm32; ComponentLink2Description: Datasheet; ComponentLink2URL: http://www.st.com/stonline/products/literature/ds/13587.pdf; Origin Footprint 2: LQFP48_N; Origin Footprint 3: LQFP48_M
U4 = TP181Ax
U5 U6 = DGD0506A
Y1 = XTAL-4: Published: 8-Jun-2000; Revision: July-2002: Re-released for DXP Platform.; Publisher: Altium Limited; Load Capactiance: 20pF; Origin Footprint 2: X2016-4

## Nets
GND: C2.1 C3.2 C4.1 C5.1 C6.2 C7.1 C8.1 C9.2 C10.2 C11.2 C12.2 C15.2 C16.2 C24.2 C26.2 C27.2 C33.2 C40.1 C41.1 C42.1 C43.2 D11.A D12.A FB1.1 P1.1 P2.2 Q1.2(S) Q5.3(S) Q7.3(S) R2.2 R3.1 R8.2 R13.2 R30.2 R35.2 R36.2 R39.2 R41.1 R44.1 R48.1 R49.2 R50.1 U1.0(EP/GND) U1.7(GND) U2.2(GND) U5.9(COM) U6.9(COM)
GNDMCU: C17.2 C18.2 C19.1 C20.1 C21.1 C22.1 C23.1 C25.2 D3.A FB1.2 FB3.2 ON/OFF1.1 P4.3(GND) P4.5(GND) P5.1 PWR1.2(K) R27.2 U3.23(VSS_1) U3.35(VSS_2) U3.44(BOOT0) U3.47(VSS_3) U4.2(GND) Y1.2(NC) Y1.4(NC)
VBAT: C9.1 C10.1 D1.A P1.2 R32.1 U4.4(IN+)
VBATO: C26.1 C27.1 C41.2 C42.2 D5.A Q4.2(D) Q6.2(D) R32.2 U4.5(IN-)
VCC3V3: C11.1 C12.1 C13.1 C20.2 C21.2 C22.2 C23.2 FB2.1 L2.1 P4.1(3V3) P5.3 Q2.2(E) Q3.2(E) R5.1 R6.1 R9.1 R11.1 R18.1 R28.2 U3.1(VBAT) U3.24(VDD_VIO_1) U3.36(VDD_2) U3.48(VDD_VIO_3) U4.3(V+)
VCC12V: C2.2 C3.1 C4.2 C15.1 C16.1 C33.1 C40.2 D4.A D8.A L1.2 P3.1 P5.2 R1.1 U2.4(EN) U2.5(IN) U5.1(VCC) U6.1(VCC)
DBGRX: P4.9(MCU-RX) U3.13(PA3/ADC3)
DBGTX: P4.7(MCU-TX) U3.12(PA2/ADC2)
DIG1: R14.2 U3.14(PA4/ADC4)
DIG2: R15.2 U3.15(PA5/ADC5)
DIGA: R19.1 U3.18(PB0/ADC8)
DIGB: R20.1 U3.19(PB1/ADC9)
DIGC: R21.1 U3.20(PB2/BOOT1)
DIGD: R22.1 U3.39(PB3/JTDO)
DIGDP: R26.1 U3.43(PB7/USB2DP)
DIGE: R23.1 U3.40(PB4/JNTRST)
DIGF: R24.1 U3.41(PB5)
DIGG: R25.1 U3.42(PB6/USB2DM)
EN: R40.1 U3.38(PA15)
FAN: P5.6 R12.1 U3.31(PA10)
LCCA: D6.A L3.1 Q4.3(S) Q5.2(D) R34.2 R37.2
LCCB: C35.1 C36.1 C37.1 C38.1 C39.1 D7.A P7.1 Q6.3(S) Q7.2(D) R43.1 R46.1
LED: STA1.2(K) U3.45(PB8)
MOD: R10.1 U3.30(PA9)
PC: C25.1 D3.K P5.5 R31.2 U3.11(PA1/ADC1)
PV: C24.1 C43.1 P5.4 R29.2 R30.1 U3.10(PA0/WKUP/ADC0)
PWMEN: P5.9 R36.1 U3.17(PA7/ADC7) U5.7(EN) U6.7(EN)
PWMINA: P5.7 R35.1 U3.16(PA6/ADC6) U5.8(IN)
PWMINB: P5.8 R44.2 U3.29(PA8) U6.8(IN)
RST: C19.2 P4.10(~RST~) R18.2 U3.7(NRST)
SWCLK: P4.4(SWCLK) U3.37(PA14/SWCLK)
SWDIO: P4.2(SWDIO) U3.34(PA13/SWDIO)
$1N4612: ON/OFF1.2 R9.2 R10.2
$1N4807: R11.2 STA1.1(A)
$1N5033: P2.1 R40.2 R41.2
$1N5719: C18.1 U3.6(OSC_OUT/PD1) Y1.3(OSC2)
$1N5749: C17.1 U3.5(OSC_IN/PD0) Y1.1(OSC1)
$1N6321: C44.1 FB2.2 U3.9(VDDA)
$1N6859: C44.2 FB3.1 U3.8(VSSA)
$1N7132: P3.2 Q1.3(D)
$1N7370: Q1.1(G) R12.2 R13.1
$1N7542: D2.9(DIG1) Q2.3(C)
$1N7545: D2.6(DIG2) Q3.3(C)
$1N7548: Q2.1(B) R14.1
$1N7551: Q3.1(B) R15.1
$1N7793: D2.7(A) R19.2
$1N7897: D2.8(B) R20.2
$1N7950: D2.3(C) R21.2
$1N8003: D2.2(D) R22.2
$1N8056: D2.1(E) R23.2
$1N8109: D2.10(F) R24.2
$1N8162: D2.4(G) R25.2
$1N8215: D2.5(DP) R26.2
$1N8723: R3.2 U1.4(RT/CLK)
$1N9081: C6.1 C7.2 C8.2 D1.K U1.2(VIN) U1.3(EN)
$1N9175: C1.1 U1.1(BOOT)
$1N9376: C1.2 L1.1 U1.8(SW)
$1N9677: R4.2 U1.6(COMP)
$1N9680: C5.2 R4.1
$1N9816: R1.2 R2.1 U1.5(FB)
$1N9982: C14.1 U2.1(BS)
$1N10863: PWR1.1(A) R5.2
$1N10932: C14.2 L2.2 U2.6(SW)
$1N24970: C28.2 C30.2 C31.2 C32.2 P6.1
$1N25020: C28.1 C30.1 C31.1 C32.1 C35.2 C36.2 C37.2 C38.2 C39.2 L3.2
$1N25510: R27.1 R28.1 U4.1(REF)
$1N25604: R31.1 U4.6(OUT)
$1N26177: D5.K R29.1
$1N26803: C29.1 D4.K D9.K U5.2(VB)
$1N26913: R49.1 U5.6(DT)
$1N27170: R38.1 U5.10(LO)
$1N27277: C29.2 D9.A R37.1 U5.4(VS)
$1N27393: R33.1 U5.3(HO)
$1N27694: D11.K Q5.1(G) R38.2 R39.1
$1N27962: D6.K Q4.1(G) R33.2 R34.1
$1N28438: D7.K Q6.1(G) R42.1 R43.2
$1N28925: D12.K Q7.1(G) R47.1 R48.2
$1N29096: R50.2 U6.6(DT)
$1N33127: C34.2 D8.K D10.K U6.2(VB)
$1N33138: R42.2 U6.3(HO)
$1N58085: R6.2 R7.2
$1N61682: R47.2 U6.10(LO)
$1N61689: C34.1 D10.A R46.2 U6.4(VS)
$1N61740: C13.2 R7.1 R8.1 U2.3(FB)

Not connected (* = marked no-connect by the designer): M1 1*; M2 1*; M3 1*; M4 1*; M5 1*; M6 1*; P4 6(NC)* 8(NC)*; U3 2(PC13/TAMPER_RTC)* 3(PC14/OSC32IN)* 4(PC15/OSC32OUT)* 21(PB10)* 22(PB11)* 25(PB12)* 26(PB13)* 27(PB14)* 28(PB15)* 32(PA11/USB1DM)* 33(PA12/USB1DP)* 46(PB9)*; U5 5(NC)*; U6 5(NC)*

## Notes on the sheet
- 开关按键
- 指示灯
- 功率显示数码管
- 12V稳压
- 预留信号接口
- 外部使能
- 风扇接口
- 3V3稳压
- 电流电压检测
- 单片机
- 电源输入接口
- LCC电路
- 发射H桥
